# EAGLE schematic Solarbrain (EAGLE 6.2)
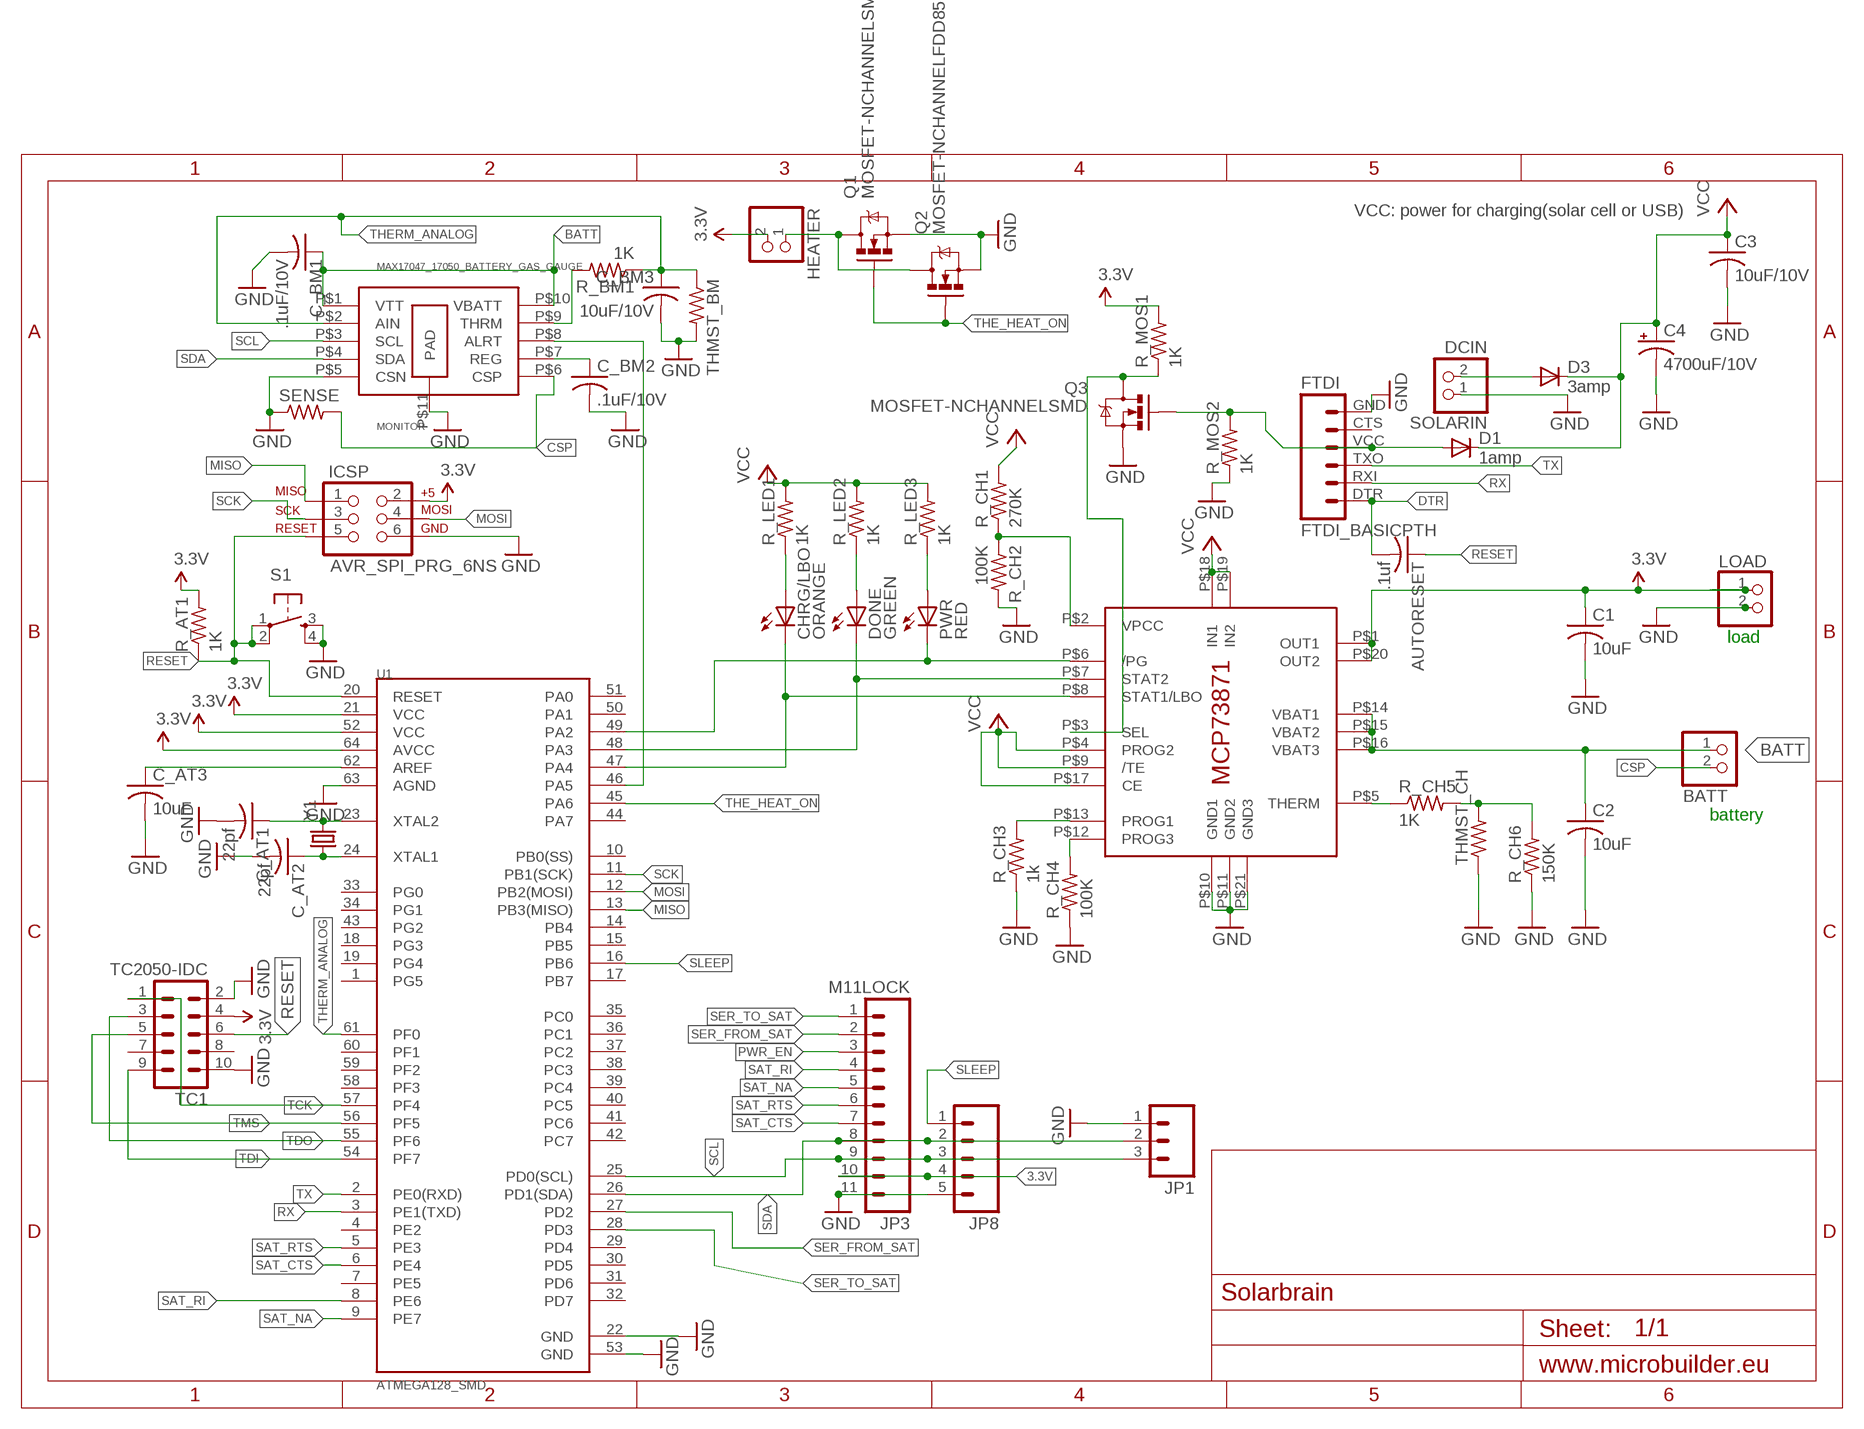
[diagram p0: schematic, sheet 1]

## Parts
AUTORESET  .1uf  C-USC0603  [C0603]
BATT  JST_2PIN-SMT-RA  [JST-PH-2-SMT-RA]
C1  10uF  C-USC0603  [C0603]
C2  10uF  C-USC0805K  [C0805K]
C3  10uF/10V  C-USC0603  [C0603]
C4  4700uF/10V  CPOL-USG  [PANASONIC_G]
C_AT1  22pf  C-USC0603K  [C0603K]
C_AT2  22pf  C-USC0603  [C0603]
C_AT3  10uF  C-USC0805K  [C0805K]
C_BM1  .1uF/10V  C-USC0603  [C0603]
C_BM2  .1uF/10V  C-USC0603  [C0603]
C_BM3  10uF/10V  C-USC0603  [C0603]
CHRG/LBO  ORANGE  LEDCHIP-LED0603  [CHIP-LED0603]
D1  1amp  DIODESMA  [SMA-DIODE]
D3  3amp  DIODESMA  [SMA-DIODE]
DONE  GREEN  LEDCHIP-LED0603  [CHIP-LED0603]
FTDI  FTDI_BASICPTH  [FTDI_BASIC]
HEATER  HEADER-1X2ROUND  [1X02_ROUND]
IC1  MCP73871  [QFN20_4MM]
ICSP  AVR_SPI_PRG_6NS  [2X3-NS]
JP1  M03PTH  [1X03]
JP3  M11LOCK  [1X11_LOCK]
JP8  M05LOCK  [1X05_LOCK]
LOAD  HEADER-1X2ROUND  [1X02_ROUND]
MONITOR  MAX17047_17050_BATTERY_GAS_GAUGE  [TDFN_10_3X3MM]
PWR  RED  LEDCHIP-LED0603  [CHIP-LED0603]
Q1  MOSFET-NCHANNELSMD  [SOT23-3]
Q2  MOSFET-NCHANNELFDD8580  [DPAK]
Q3  MOSFET-NCHANNELSMD  [SOT23-3]
R_AT1  1K  R-US_R0603  [R0603]
R_BM1  1K  R-US_R0603  [R0603]
R_CH1  270K  R-US_R0603  [R0603]
R_CH2  100K  R-US_R0603  [R0603]
R_CH3  1k  R-US_R0603  [R0603]
R_CH4  100K  R-US_R0603  [R0603]
R_CH5  1K  R-US_R0603  [R0603]
R_CH6  150K  R-US_R0603  [R0603]
R_LED1  1K  R-US_R0603  [R0603]
R_LED2  1K  R-US_R0603  [R0603]
R_LED3  1K  R-US_R0603  [R0603]
R_MOS1  1K  R-US_R0603  [R0603]
R_MOS2  1K  R-US_R0603  [R0603]
S1  TAC_SWITCHSMD  [TACTILE_SWITCH_SMD]
SENSE  R-US_R3225  [R3225]
SOLARIN  DCIN  HEADER-1X2ROUND  [1X02_ROUND]
TC1  TC2050-IDC  [TC2050-IDC]
THMST_BM  R-US_R0603  [R0603]
THMST_CH  R-US_R0603  [R0603]
U1  ATMEGA128_SMD  [TQFP64]
Y1  CRYSTAL5X3  [CRYSTAL-SMD-5X3]

## Nets
3.3V [power]: C1.1 HEATER.2 IC1.P$1(OUT1) IC1.P$20(OUT2) ICSP.2 JP3.10 JP8.4 LOAD.1 R_AT1.2 R_MOS1.2 TC1.4 U1.21(VCC) U1.52(VCC) U1.64(AVCC)
#PG: IC1.P$6(/PG) PWR.C U1.49(PA2)
BATT [power]: BATT.1 C2.1 C_BM1.1 IC1.P$14(VBAT1) IC1.P$15(VBAT2) IC1.P$16(VBAT3) MONITOR.P$1(VTT) MONITOR.P$10(VBATT)
CSP [power]: BATT.2 MONITOR.P$6(CSP) SENSE.2
DTR [power]: AUTORESET.2 FTDI.DTR
GND [power]: C1.2 C2.2 C3.2 C4.- C_AT1.2 C_AT2.2 C_AT3.2 C_BM1.2 C_BM2.2 C_BM3.2 FTDI.GND IC1.P$10(GND1) IC1.P$11(GND2) IC1.P$21(GND3) ICSP.6 JP1.1 JP3.11 JP8.5 LOAD.2 MONITOR.P$5(CSN) MONITOR.P$11(PAD) Q1.2(S) Q2.3(S) Q3.2(S) R_CH2.2 R_CH3.1 R_CH4.1 R_CH6.1 R_MOS2.1 S1.3 S1.4 SENSE.1 SOLARIN.1 TC1.2 TC1.10 THMST_BM.2 THMST_CH.1 U1.22(GND) U1.53(GND) U1.63(AGND)
MISO [power]: ICSP.1 U1.13(PB3(MISO))
MOSI [power]: ICSP.4 U1.12(PB2(MOSI))
N$2 [power]: D1.A FTDI.VCC Q3.1(G) R_MOS2.2
N$3 [power]: C_AT1.1 U1.23(XTAL2) Y1.3
N$5: IC1.P$5(THERM) R_CH5.1
N$8: R_CH5.2 R_CH6.2 THMST_CH.2
N$9 [power]: C_AT2.1 U1.24(XTAL1) Y1.1
N$12: CHRG/LBO.A R_LED1.1
N$13: DONE.A R_LED2.1
N$14: PWR.A R_LED3.1
N$19 [power]: MONITOR.P$8(ALRT) U1.46(PA5)
N$20 [power]: C_AT3.1 U1.62(AREF)
N$21 [power]: HEATER.1 Q1.3(D) Q2.4(D)
N$22 [power]: MONITOR.P$9(THRM) R_BM1.2
N$24 [power]: D3.A SOLARIN.2
N$26 [power]: C_BM2.1 MONITOR.P$7(REG)
PROG1: IC1.P$13(PROG1) R_CH3.2
PROG3: IC1.P$12(PROG3) R_CH4.2
PWR_EN: JP3.3
RESET [power]: AUTORESET.1 ICSP.5 R_AT1.1 S1.1 S1.2 TC1.6 U1.20(RESET)
RX [power]: FTDI.RXI U1.3(PE1(TXD))
SAT_CTS: JP3.7 U1.6(PE4)
SAT_NA [power]: JP3.5 U1.9(PE7)
SAT_RI [power]: JP3.4 U1.8(PE6)
SAT_RTS [power]: JP3.6 U1.5(PE3)
SCK [power]: ICSP.3 U1.11(PB1(SCK))
SCL [power]: JP1.3 JP3.9 JP8.3 MONITOR.P$3(SCL) U1.25(PD0(SCL))
SDA [power]: JP1.2 JP3.8 JP8.2 MONITOR.P$4(SDA) U1.26(PD1(SDA))
SEL [power]: IC1.P$3(SEL) Q3.3(D) R_MOS1.1
SER_FROM_SAT: JP3.2 U1.27(PD2)
SER_TO_SAT: JP3.1 U1.28(PD3)
SLEEP: JP8.1 U1.16(PB6)
STAT1: CHRG/LBO.C IC1.P$8(STAT1/LBO) U1.47(PA4)
STAT2: DONE.C IC1.P$7(STAT2) U1.48(PA3)
TCK [power]: TC1.1 U1.57(PF4)
TDI [power]: TC1.9 U1.54(PF7)
TDO [power]: TC1.3 U1.55(PF6)
THE_HEAT_ON [power]: Q1.1(G) Q2.1(G) U1.45(PA6)
THERM_ANALOG [power]: C_BM3.1 MONITOR.P$2(AIN) R_BM1.1 THMST_BM.1 U1.61(PF0)
TMS [power]: TC1.5 U1.56(PF5)
TX [power]: FTDI.TXO U1.2(PE0(RXD))
VCC [power]: C3.1 C4.+ D1.C D3.C IC1.P$4(PROG2) IC1.P$9(/TE) IC1.P$17(CE) IC1.P$18(IN1) IC1.P$19(IN2) R_CH1.2 R_LED1.2 R_LED2.2 R_LED3.2
VPCC: IC1.P$2(VPCC) R_CH1.1 R_CH2.1
Unconnected: FTDI.CTS TC1.7 TC1.8 U1.1(PG5) U1.4(PE2) U1.7(PE5) U1.10(PB0(SS)) U1.14(PB4) U1.15(PB5) U1.17(PB7) U1.18(PG3) U1.19(PG4) U1.29(PD4) U1.30(PD5) U1.31(PD6) U1.32(PD7) U1.33(PG0) U1.34(PG1) U1.35(PC0) U1.36(PC1) U1.37(PC2) U1.38(PC3) U1.39(PC4) U1.40(PC5) U1.41(PC6) U1.42(PC7) U1.43(PG2) U1.44(PA7) U1.50(PA1) U1.51(PA0) U1.58(PF3) U1.59(PF2) U1.60(PF1)

## Notes on the sheet
- VCC: power for charging(solar cell or USB)
- load
- battery

## Library data of the parts
AUTORESET C1-C3 C_AT1-C_AT3 C_BM1-C_BM3 = adafruit:C-US: CAPACITOR, American symbol
BATT = adafruit:JST_2PIN: JST 2-Pin Connectors of various flavors SMT-RA (S2B-PH-SM4) 4UConnector #17311 SMT (B2B-PH-SM4) THM-RA (S2B-PH) THM (B2B-PH)
C4 = adafruit:CPOL-US: POLARIZED CAPACITOR, American symbol
CHRG/LBO DONE PWR = adafruit:LED: LED OSRAM: - CHIPLED LG R971, LG N971, LY N971, LG Q971, LY Q971, LO R971, LY R971 LH N974, LH R974 LS Q976, LO Q976, LY Q976 LO Q996 - Hyper CHIPLED LW Q18S LB Q993, LB Q99A, LB R99A - SideLED LS A670, LO A670, LY A670, LG A670, LP A670 LB A673, LV A673, LT A673, LW A673 LH A674 LY A675 LS A676, LA A676, LO A676, LY A676, LW A676 LS A679, LY A679, LG A679 - Hyper Micro SIDELED® LS Y876, LA Y876, LO Y876, LY Y876 LT Y87S - SmartLED LW L88C, LW L88S LB L89C, LB L89S, LG L890 LS L89K, LO L89K, LY L89K LS L896, LA L896, LO L896, LY L896 - TOPLED LS T670, LO T670, LY T670, LG T670, LP T670 LSG T670, LSP T670, LSY T670, LOP T670, LYG T670 LG T671, LOG T671, LSG T671 LB T673, LV T673, LT T673, LW T673 LH T674 LS T676, LA T676, LO T676, LY T676, LB T676, LH T676, LSB T676, LW T676 LB T67C, LV T67C, LT T67C, LS T67K, LO T67K, LY T67K, LW E67C LS E67B, LA E67B, LO E67B, LY E67B, LB E67C, LV E67C, LT E67C LW T67C LS T679, LY T679, LG T679 LS T770, LO T770, LY T770, LG T770, LP T770 LB T773, LV T773, LT T773, LW T773 LH T774 LS E675, LA E675, LY E675, LS T675 LS T776, LA T776, LO T776, LY T776, LB T776 LHGB T686 LT T68C, LB T68C - Hyper Mini TOPLED® LB M676 - Mini TOPLED Santana® LG M470 LS M47K, LO M47K, LY M47K Source: http://www.osram.convergy.de/
D1 D3 = SparkFun2011:DIODE: Diode These are standard reverse protection diodes and small signal diodes. SMA package can handle up to about 1A. SOD-323 can handle about 200mA. What the SOD-323 package when ordering, there are some mfgs out there that are 5-pin packages.
FTDI = SparkFun2011:FTDI_BASIC: FTDI Basic: 3.3V and 5V
HEATER LOAD SOLARIN = microbuilder:HEADER-1X2: PIN HEADER
IC1 = adafruit:MCP73871
ICSP = SparkFun2011:AVR_SPI_PRG_6: AVR ISP 6 Pin This is the reduced ISP connector for AVR programming. Common on Arduino. This footprint will take up less PCB space and can be used with a 10-pin to 6-pin adapter such as SKU: BOB-08508
JP1 = SparkFun2011:M03: Header 3 Standard 3-pin 0.1" header. Use with straight break away headers (SKU : PRT-00116), right angle break away headers (PRT-00553), swiss pins (PRT-00743), machine pins (PRT-00117), and female headers (PRT-00115). Molex polarized connector foot print use with SKU : PRT-08232 with associated crimp pins and housings.
JP3 = SparkFun2011:M11: Header 11 Standard 11-pin 0.1" header. Use with straight break away headers (SKU : PRT-00116), right angle break away headers (PRT-00553), swiss pins (PRT-00743), machine pins (PRT-00117), and female headers (PRT-00115).
JP8 = SparkFun2011:M05: Header 5 Standard 5-pin 0.1" header. Use with straight break away headers (SKU : PRT-00116), right angle break away headers (PRT-00553), swiss pins (PRT-00743), machine pins (PRT-00117), and female headers (PRT-00115). Molex polarized connector foot print use with SKU : PRT-08230 with associated crimp pins and housings.
MONITOR = RaphaelBigLibrary:MAX17047_17050_BATTERY_GAS_GAUGE
Q1-Q3 = SparkFun2011:MOSFET-NCHANNEL
R_AT1 R_BM1 R_CH1-R_CH6 R_LED1-R_LED3 R_MOS1 R_MOS2 = adafruit:R-US_: RESISTOR, American symbol
S1 = SparkFun2011:TAC_SWITCH: Momentary Switch Button commonly used for reset or general input. Spark Fun Electronics SKU : COM-00097
SENSE THMST_BM THMST_CH = rcl:R-US_: RESISTOR, American symbol
TC1 = TagConnect:TC2050-IDC: Tag-Connect In Circuit Programming & Debug Cable 10 Pin http://www.tag-connect.com
U1 = SparkFun2011:ATMEGA128: ATmega128/128L/1281/2561. Note: The ATmega128 pin 1 is PEN and the ATmega256/1281 pin 1 is PG5.
Y1 = SparkFun2011:CRYSTAL: Crystals Various standard crystals. Proven footprints. Spark Fun Electronics SKU : COM-00534

## Net classes
0 default: width 0.178 mm, drill 0.381 mm, clearance 0.178 mm
1 power: width 0.178 mm, drill 0.381 mm, clearance 0.178 mm